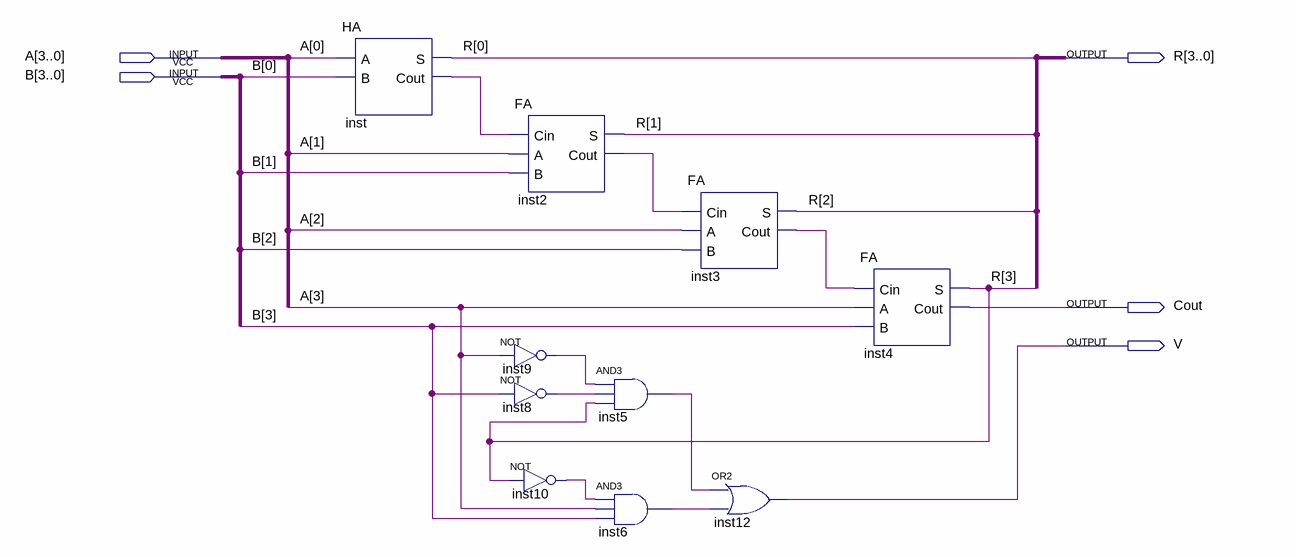
[diagram p0: schematic sheet]
// Quartus schematic Suma.bdf as structural Verilog: 10 symbols, 5 pins
module Suma (
  input  [3:0] A,
  input  [3:0] B,
  output [3:0] R,
  output Cout,
  output V
);

  wire inst2_cout, inst3_cout, inst5_out, inst6_out, inst8_out, inst9_out, inst10_out, inst_cout;

  HA inst (.A(A[0]), .B(B[0]), .S(R[0]), .Cout(inst_cout));
  not inst9 (inst9_out, A[3]);
  not inst8 (inst8_out, B[3]);
  FA inst2 (.Cin(inst_cout), .A(A[1]), .B(B[1]), .S(R[1]), .Cout(inst2_cout));
  not inst10 (inst10_out, R[3]);
  and inst5 (inst5_out, inst9_out, inst8_out, R[3]);
  and inst6 (inst6_out, inst10_out, A[3], B[3]);
  FA inst3 (.Cin(inst2_cout), .A(A[2]), .B(B[2]), .S(R[2]), .Cout(inst3_cout));
  or inst12 (V, inst5_out, inst6_out);
  FA inst4 (.Cin(inst3_cout), .A(A[3]), .B(B[3]), .S(R[3]), .Cout(Cout));
endmodule
